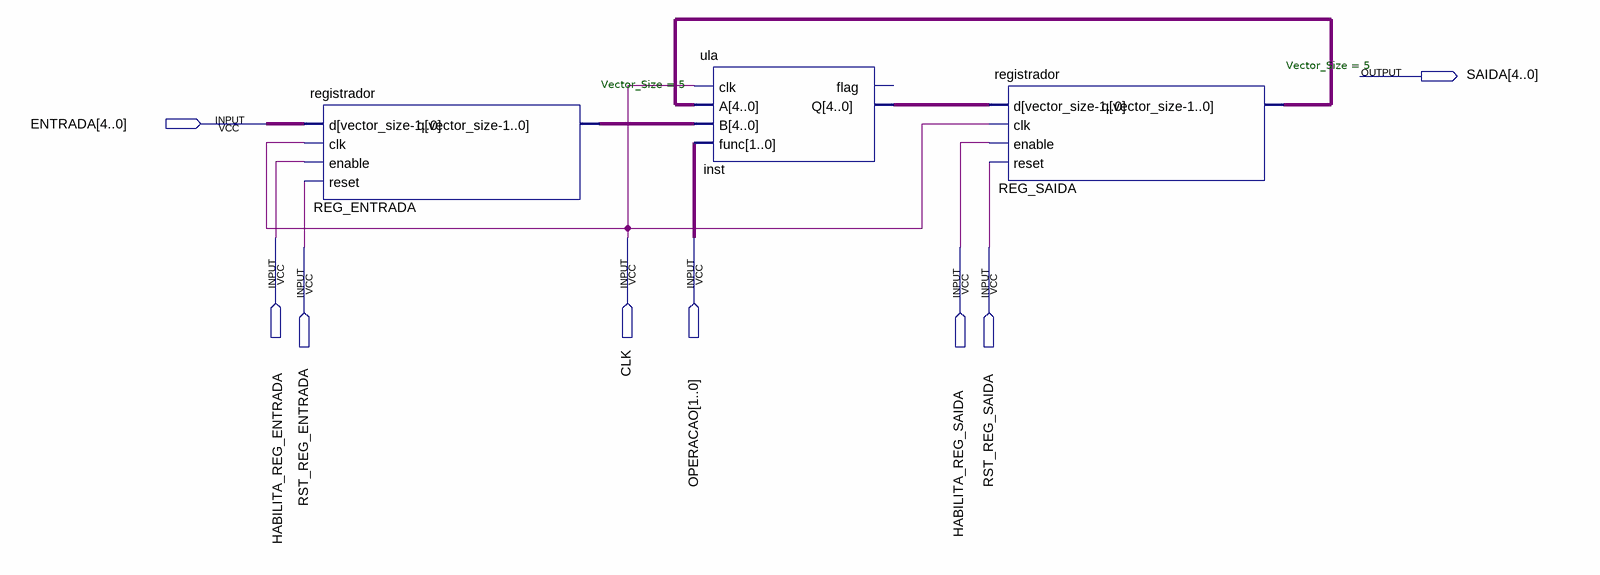
[diagram p0: schematic sheet]
// Quartus schematic circuito_combinacional.bdf as structural Verilog: 3 symbols, 8 pins
module circuito_combinacional (
  input  [4:0] ENTRADA,
  input  HABILITA_REG_ENTRADA,
  input  CLK,
  input  [1:0] OPERACAO,
  input  RST_REG_ENTRADA,
  input  HABILITA_REG_SAIDA,
  input  RST_REG_SAIDA,
  output [4:0] SAIDA
);

  wire [4:0] inst_q, REG_ENTRADA_q, REG_SAIDA_q;

  registrador #(.Vector_Size(5)) REG_ENTRADA (
    .d(ENTRADA), .clk(CLK), .enable(HABILITA_REG_ENTRADA), .reset(RST_REG_ENTRADA), .q(REG_ENTRADA_q));
  ula inst (.clk(CLK), .A(REG_SAIDA_q), .B(REG_ENTRADA_q), .func(OPERACAO), .Q(inst_q));  // open: flag
  registrador #(.Vector_Size(5)) REG_SAIDA (
    .d(inst_q), .clk(CLK), .enable(HABILITA_REG_SAIDA), .reset(RST_REG_SAIDA), .q(REG_SAIDA_q));
endmodule
